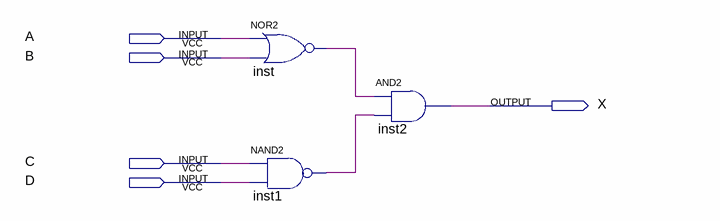
[diagram p0: schematic sheet]
// Quartus schematic SimpleGates_sch.bdf as structural Verilog: 3 symbols, 5 pins
module SimpleGates_sch (
  input  A,
  input  B,
  input  C,
  input  D,
  output X
);

  wire inst1_out, inst_out;

  nor inst (inst_out, A, B);
  nand inst1 (inst1_out, C, D);
  and inst2 (X, inst_out, inst1_out);
endmodule
